# EAGLE design HVIBDC (EAGLE 9.5.1)
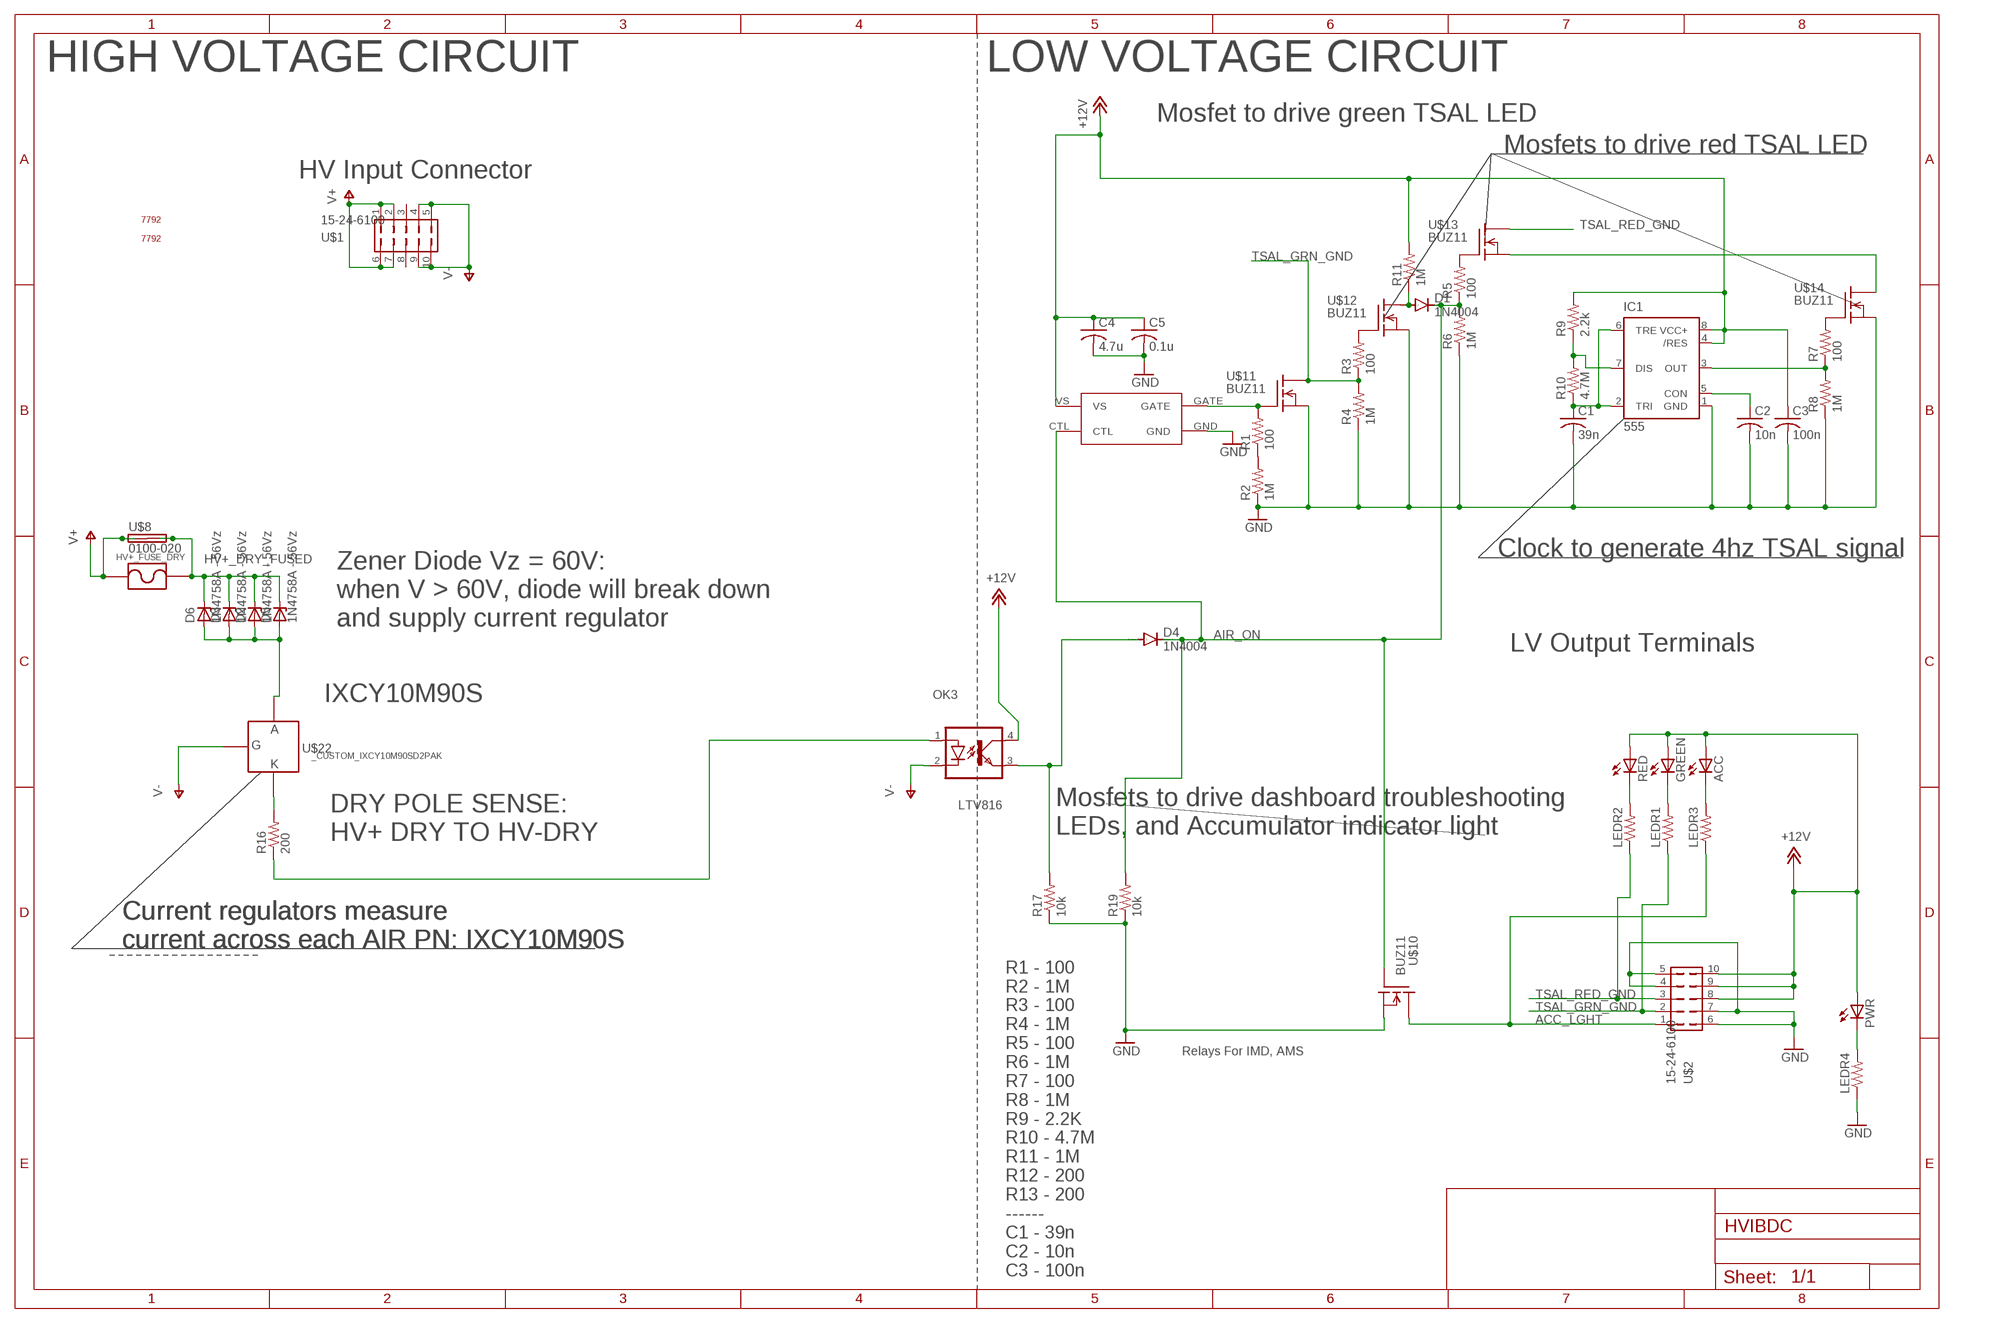
[diagram p0: schematic, sheet 1]

## Parts
ACC  LEDCHIPLED_0805  [CHIPLED_0805]
C1  39n  C-USC0805  [C0805]
C2  10n  C-USC0805  [C0805]
C3  100n  C-USC0805  [C0805]
C4  4.7u  C-USC0805  [C0805]
C5  0.1u  C-USC0805  [C0805]
D1  1N4004  [DO41-10]
D2  1N4758A - 56Vz  ZENER-DIODEZD-12.5  [ZDIO12.5]
D3  1N4758A - 56Vz  ZENER-DIODEZD-12.5  [ZDIO12.5]
D4  1N4004  [DO41-10]
D5  1N4758A - 56Vz  ZENER-DIODEZD-12.5  [ZDIO12.5]
D6  1N4758A - 56Vz  ZENER-DIODEZD-12.5  [ZDIO12.5]
GREEN  LEDCHIPLED_0805  [CHIPLED_0805]
HV+_FUSE_DRY  _CUSTOM_PARTS_LF_885  [_CUSTOM_PARTS_LF_885]
IC1  555  555P  [DIP08]
LEDR1  R-US_R0805  [R0805]
LEDR2  R-US_R0805  [R0805]
LEDR3  R-US_R0805  [R0805]
LEDR4  R-US_R0805  [R0805]
OK3  LTV816  [DIL04]
PWR  LEDCHIPLED_0805  [CHIPLED_0805]
R1  100  R-US_R0805  [R0805]
R2  1M  R-US_R0805  [R0805]
R3  100  R-US_R0805  [R0805]
R4  1M  R-US_R0805  [R0805]
R5  100  R-US_R0805  [R0805]
R6  1M  R-US_R0805  [R0805]
R7  100  R-US_R0805  [R0805]
R8  1M  R-US_R0805  [R0805]
R9  2.2k  R-US_R0805  [R0805]
R10  4.7M  R-US_R0805  [R0805]
R11  1M  R-US_R0805  [R0805]
R16  200  R-US_R2010  [R2010]
R17  10k  R-US_R0805  [R0805]
R19  10k  R-US_R0805  [R0805]
RED  LEDCHIPLED_0805  [CHIPLED_0805]
U$1  15-24-6100  [15-24-6100]
U$2  15-24-6100  [15-24-6100]
U$3  7792  [7792]
U$4  7792  [7792]
U$8  0100-020  [0100-020]
U$10  BUZ11  [TO220]
U$11  BUZ11  [TO220]
U$12  BUZ11  [TO220]
U$13  BUZ11  [TO220]
U$14  BUZ11  [TO220]
U$15  MIC4417  [PDM_2019_REVB_MIC4416YM4-TR]
U$22  _CUSTOM_IXCY10M90SD2PAK  [TO228P991X238-3]

## Nets
+12V: ACC.A C3.1 C4.1 C5.1 GREEN.A IC1.4(/RES) IC1.8(VCC+) OK3.4(COL) PWR.A R9.2 R11.2 RED.A U$2.8 U$2.9 U$2.10 U$15.VS
ACC_LGHT: LEDR3.1 U$2.1 U$10.2(D)
AIR_ON: D1.C D4.C R5.1 R6.2 R19.2 U$10.1(G) U$15.CTL
GND: C1.2 C2.2 C3.2 C4.2 C5.2 IC1.1(GND) LEDR4.1 R2.1 R4.1 R6.1 R8.1 R17.1 R19.1 U$2.4 U$2.5 U$2.6 U$2.7 U$10.3(S) U$11.3(S) U$12.3(S) U$14.3(S) U$15.GND
HV+_DRY_FUSED [HV]: D2.C D3.C D5.C D6.C HV+_FUSE_DRY.P$1 U$8.P$2(2A) U$8.P$4(2B)
N$1: R1.1 R2.2
N$2: R1.2 U$11.1(G) U$15.GATE
N$3: R3.2 U$12.1(G)
N$4: C2.1 IC1.5(CON)
N$5: IC1.7(DIS) R9.1 R10.2
N$6: R5.2 U$13.1(G)
N$7: R7.2 U$14.1(G)
N$8: IC1.3(OUT) R7.1 R8.2
N$9: C1.1 IC1.2(TRI) IC1.6(TRE) R10.1
N$10: ACC.C LEDR3.2
N$12: GREEN.C LEDR1.2
N$13: U$13.3(S) U$14.2(D)
N$14: D4.A OK3.3(EMIT) R17.2
N$15: D1.A R11.1 U$12.2(D)
N$16: LEDR2.2 RED.C
N$17: LEDR4.2 PWR.C
N$20 [HV]: R16.2 U$22.2(K)
N$21 [HV]: D2.A D3.A D5.A D6.A U$22.3(A)
N$22 [HV]: OK3.1(A) R16.1
TSAL_GRN_GND: LEDR1.1 R3.1 R4.2 U$2.2 U$11.2(D)
TSAL_RED_GND: LEDR2.1 U$2.3 U$13.2(D)
V+ [HV]: HV+_FUSE_DRY.P$2 U$1.1 U$1.2 U$1.6 U$1.7 U$8.P$1(1A) U$8.P$3(1B)
V- [HV]: OK3.2(C) U$1.4 U$1.5 U$1.9 U$1.10 U$22.1(G)
Unconnected: U$1.3 U$1.8

## Notes on the sheet
- HIGH VOLTAGE CIRCUIT | LOW VOLTAGE CIRCUIT
- Mosfet to drive green TSAL LED
- Mosfets to drive red TSAL LED
- HV Input Connector
- Clock to generate 4hz TSAL signal
- Zener Diode Vz = 60V: 
  when V > 60V, diode will break down 
  and supply current regulator
- LV Output Terminals
- IXCY10M90S
- Mosfets to drive dashboard troubleshooting
  LEDs, and Accumulator indicator light
- DRY POLE SENSE:
  HV+ DRY TO HV-DRY
- Current regulators measure 
  current across each AIR PN: IXCY10M90S
- Current regulators measure 
  current across each AIR PN: IXCY10M90S
- Current regulators measure 
  current across each AIR PN: IXCY10M90S
- Relays For IMD, AMS
- R1 - 100
  R2 - 1M
  R3 - 100
  R4 - 1M
  R5 - 100
  R6 - 1M
  R7 - 100
  R8 - 1M
  R9 - 2.2K
  R10 - 4.7M
  R11 - 1M
  R12 - 200
  R13 - 200
  ------
  C1 - 39n
  C2 - 10n
  C3 - 100n

## Library data of the parts
ACC GREEN PWR RED = ACC-MB-R0:LED: LED OSRAM: - CHIPLED LG R971, LG N971, LY N971, LG Q971, LY Q971, LO R971, LY R971 LH N974, LH R974 LS Q976, LO Q976, LY Q976 LO Q996 - Hyper CHIPLED LW Q18S LB Q993, LB Q99A, LB R99A - SideLED LS A670, LO A670, LY A670, LG A670, LP A670 LB A673, LV A673, LT A673, LW A673 LH A674 LY A675 LS A676, LA A676, LO A676, LY A676, LW A676 LS A679, LY A679, LG A679 - Hyper Micro SIDELED® LS Y876, LA Y876, LO Y876, LY Y876 LT Y87S - SmartLED LW L88C, LW L88S LB L89C, LB L89S, LG L890 LS L89K, LO L89K, LY L89K LS L896, LA L896, LO L896, LY L896 - TOPLED LS T670, LO T670, LY T670, LG T670, LP T670 LSG T670, LSP T670, LSY T670, LOP T670, LYG T670 LG T671, LOG T671, LSG T671 LB T673, LV T673, LT T673, LW T673 LH T674 LS T676, LA T676, LO T676, LY T676, LB T676, LH T676, LSB T676, LW T676 LB T67C, LV T67C, LT T67C, LS T67K, LO T67K, LY T67K, LW E67C LS E67B, LA E67B, LO E67B, LY E67B, LB E67C, LV E67C, LT E67C LW T67C LS T679, LY T679, LG T679 LS T770, LO T770, LY T770, LG T770, LP T770 LB T773, LV T773, LT T773, LW T773 LH T774 LS E675, LA E675, LY E675, LS T675 LS T776, LA T776, LO T776, LY T776, LB T776 LHGB T686 LT T68C, LB T68C - Hyper Mini TOPLED® LB M676 - Mini TOPLED Santana® LG M470 LS M47K, LO M47K, LY M47K Source: http://www.osram.convergy.de LUXEON: - LUMILED® LXK2-PW12-R00, LXK2-PW12-S00, LXK2-PW14-U00, LXK2-PW14-V00 LXK2-PM12-R00, LXK2-PM12-S00, LXK2-PM14-U00 LXK2-PE12-Q00, LXK2-PE12-R00, LXK2-PE12-S00, LXK2-PE14-T00, LXK2-PE14-U00 LXK2-PB12-K00, LXK2-PB12-L00, LXK2-PB12-M00, LXK2-PB14-N00, LXK2-PB14-P00, LXK2-PB14-Q00 LXK2-PR12-L00, LXK2-PR12-M00, LXK2-PR14-Q00, LXK2-PR14-R00 LXK2-PD12-Q00, LXK2-PD12-R00, LXK2-PD12-S00 LXK2-PH12-R00, LXK2-PH12-S00 LXK2-PL12-P00, LXK2-PL12-Q00, LXK2-PL12-R00 Source: www.luxeon.com KINGBRIGHT: KA-3528ASYC Source: www.kingbright.com
C1-C5 = resistor:C-US: CAPACITOR, American symbol
D1 D4 = diode:1N4004: DIODE general purpose rectifier, 1 A
D2 D3 D5 D6 = Main:ZENER-DIODE: Z-Diode
HV+_FUSE_DRY = Main:_CUSTOM_PARTS_LF_885
IC1 = SparkFun-IC-Special-Function:555: General purpose bipolar Timer Datasheet <http://www.sparkfun.com/datasheets/Components/General/ne555.pdf> SparkFun Products SparkFun SparkPunk Sequencer Kit <https://www.sparkfun.com/products/12707> (KIT-12707) Storefront Component: 555 Timer <https://www.sparkfun.com/products/9273> (COM-09273) Two parts valid for production: VFP: IC-11930 (M7555 PTH) VFP: IC-09173 (555 PTH) - Preferred; PROD_ID: IC-09173; PROD_ID_ALT: IC-09173
LEDR1-LEDR4 = ACC-MB-R0:R-US_: RESISTOR, American symbol; SPICEPREFIX: R
OK3 = optocoupler:LTV816: OPTO COUPLER Source: LITEON, LTV816.pdf; OC_FARNELL: unknown; OC_NEWARK: unknown
R1-R11 R17 R19 = resistor:R-US_: RESISTOR, American symbol
R16 = Main:R-US_: RESISTOR, American symbol; SPICEPREFIX: R
U$1 U$2 = ACC-MB-R0:15-24-6100
U$3 U$4 = ACC-MB-R0:7792
U$8 = ACC-MB-R0:0100-020
U$10-U$14 = transistor-fet:BUZ11: N-Channel Enhancement MOSFET 50V; 30A; 0,040Ohm
U$15 = HVIB_v2:MIC4417; MPN: MIC4417
U$22 = Main:_CUSTOM_IXCY10M90S

## Net classes
0 default: width 0.2 mm, clearance 0.2 mm
2 HV: width 1.27 mm, clearance 1.5 mm to class 0, clearance 1.5 mm to class 1, clearance 1.5 mm

## Board
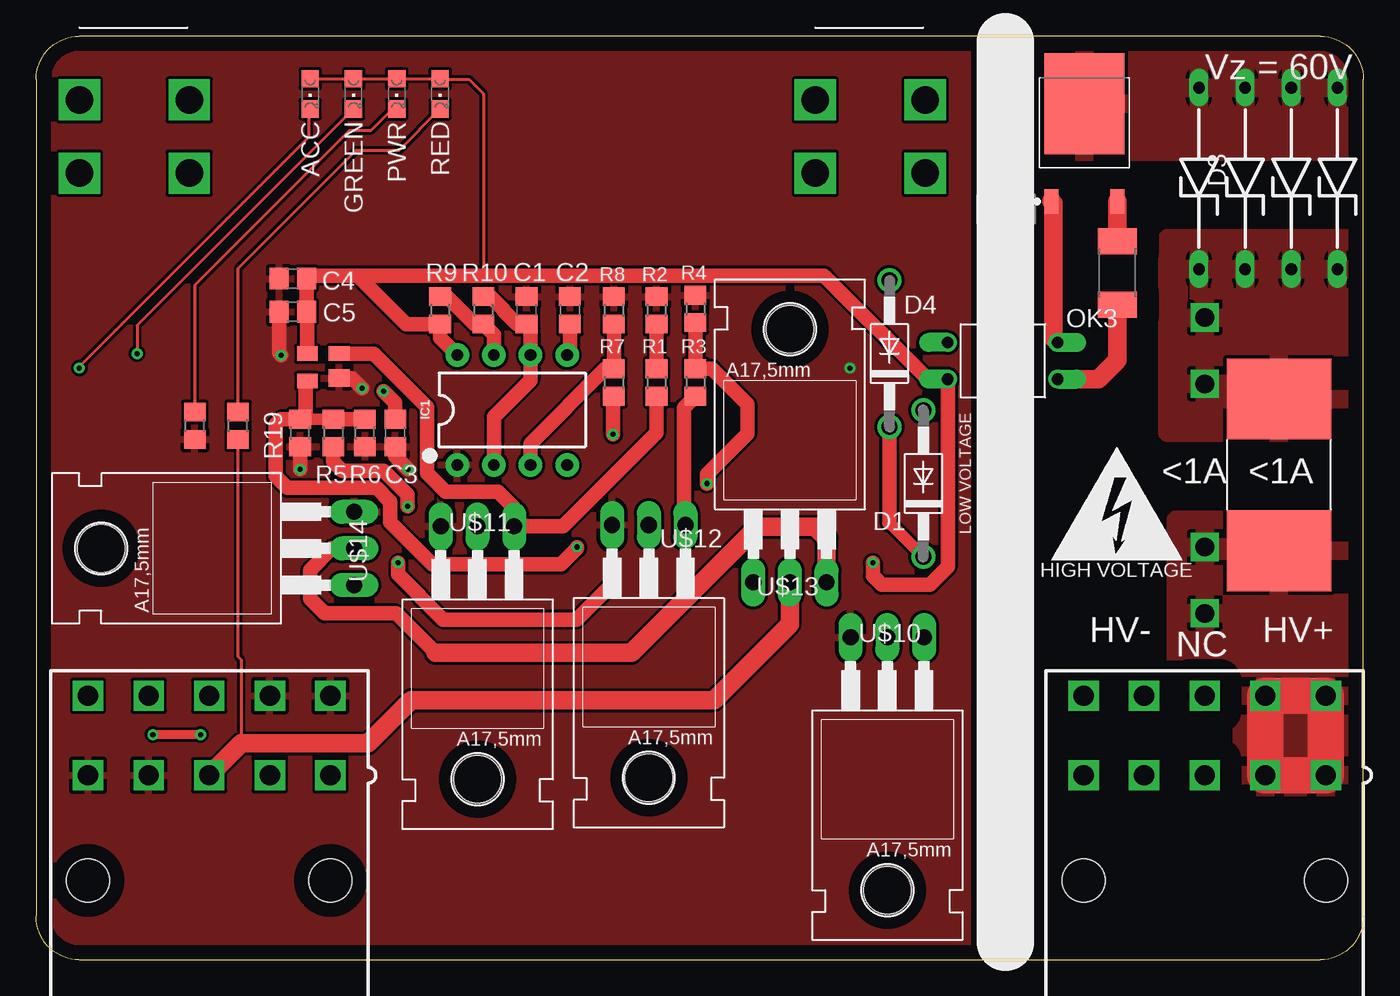
[diagram p1: board, top side]
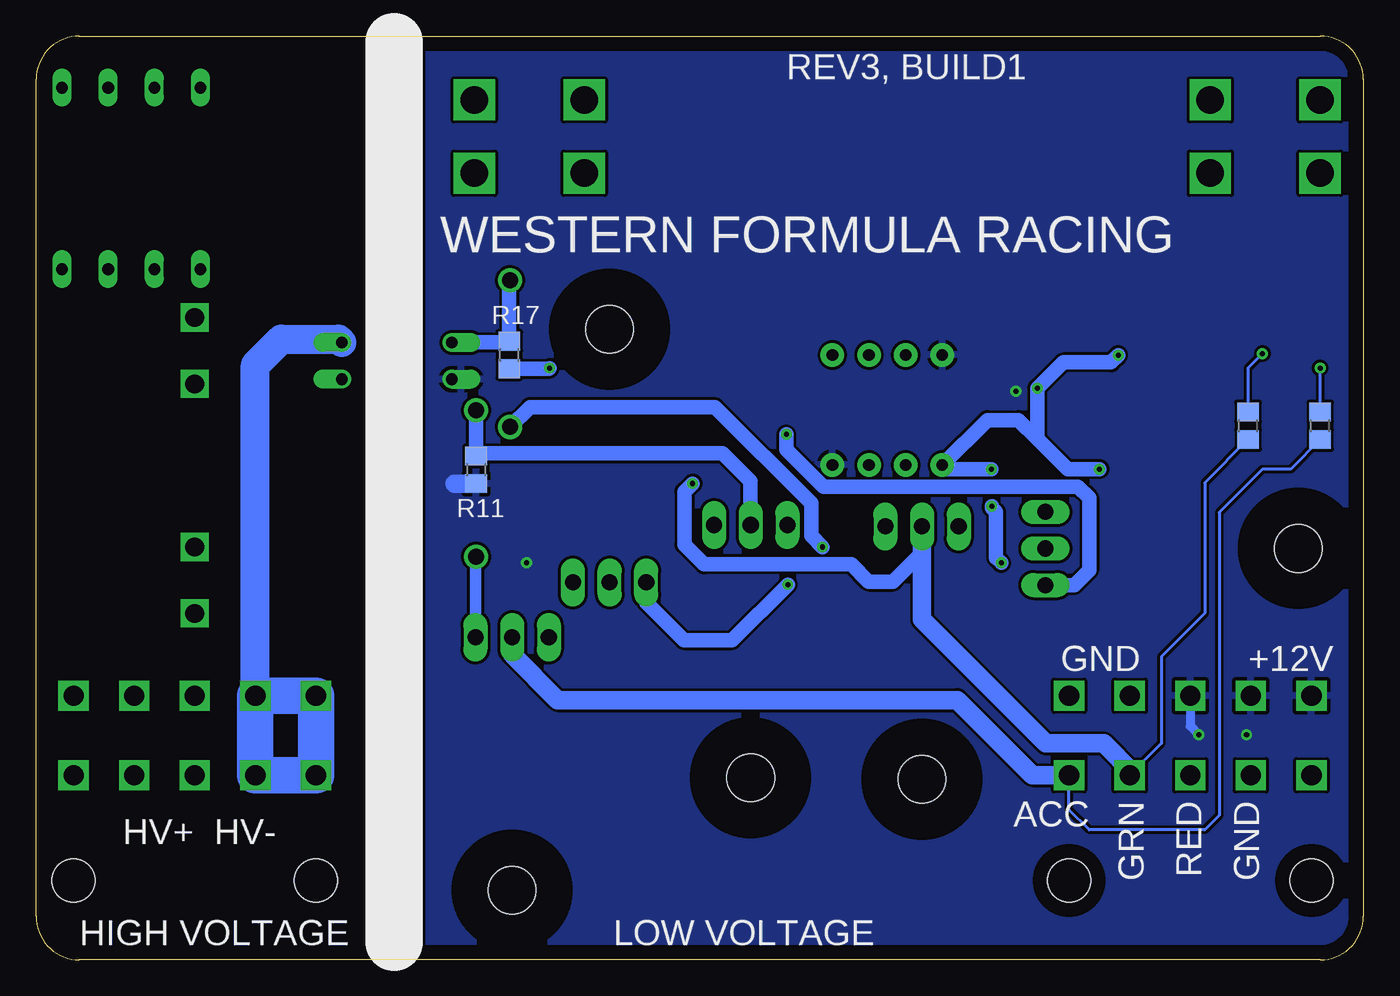
[diagram p2: board, bottom side, seen from below]

Size 92 x 64 mm. Coordinates in mm from the lower left corner, seen from the top.
Outline: 3,0 89,0 arc90 92,3 92,61 arc90 89,64 3,64 arc90 0,61 0,3 arc90 3,0
Copper layers (1*16): Top 0.035mm / dielectric 1.5mm / Bottom 0.035mm
Design rules "default": minimum track width 6mil, minimum drill 0.35mm, track to track 6mil, track to pad 6mil, pad to pad 6mil, via to via 6mil, smd to smd 6mil, copper to edge 40mil, drill to drill 6mil, minimum pad ring 10mil, minimum via ring 8mil, stop-mask expansion 4mil, vias tented up to drill 0mil, thermal gap 10mil

### Footprints (pad centres in the part's own frame; a part is rotated, then mirrored left to right if it is on the bottom)
CHIPLED_0805 = smd 1.2 x 1.2: A 0,-1.05; C 0,1.05
C0805 = smd 1.3 x 1.5: 1 -0.95,0; 2 0.95,0
DO41-10 = drill 1.118: A 5.08,0; C -5.08,0
ZDIO12.5 = drill 0.813 long: A 6.223,0; C -6.35,0
_CUSTOM_PARTS_LF_885 = smd 5.6 x 7.23: P$1 5.25,0; P$2 -5.25,0
DIP08 = drill 0.813 pad 1.626: 1 -3.81,-3.81; 2 -1.27,-3.81; 3 1.27,-3.81; 4 3.81,-3.81; 5 3.81,3.81; 6 1.27,3.81; 7 -1.27,3.81; 8 -3.81,3.81
R0805 = smd 1.3 x 1.5: 1 -0.95,0; 2 0.95,0
DIL04 = drill 0.813 offset: 1 -1.27,-3.81; 2 1.27,-3.81; 3 1.27,3.81; 4 -1.27,3.81
R2010 = smd 1.8 x 2.7: 1 -2.2,0; 2 2.2,0
15-24-6100 = drill 1.4 square: 1 8.4,-2.75; 2 4.2,-2.75; 3 0,-2.75; 4 -4.2,-2.75; 5 -8.4,-2.75; 6 8.4,2.75; 7 4.2,2.75; 8 0,2.75; 9 -4.2,2.75; 10 -8.4,2.75 | hole 3: 8.4,-10.05; -8.4,-10.05
7792 = drill 1.905 square: P$1 0,5.08; P$2 7.62,5.08; P$3 7.62,0; P$4 0,0
0100-020 = drill 1.3 square: P$1 0,0; P$2 15.9,0; P$3 4.6,0; P$4 20.5,0
TO220 = drill 1.118 long: 1 -2.54,-6.35; 2 0,-6.35; 3 2.54,-6.35 | hole 3.302: 0,11.176
PDM_2019_REVB_MIC4416YM4-TR = smd 1 x 1.44: CTL 0,0; GATE 1.9,-2.2; VS 1.9,0 | smd 1.2 x 1.44: GND 0.2,-2.2
TO228P991X238-3 = smd 1.718 x 0.974: 1 -4.704,2.28; 2 -4.704,-2.28 | smd 7.001 x 5.544: 3 2.063,0

### Placement (x,y rotation side)
ACC  19,60 180 top
C1  34,45 90 top
C2  37,45 90 top
C3  24.9,36.5 270 top
C4  17.8,47.2 180 top
C5  17.8,44.9 180 top
D1  61.5,33 90 top
D2  87,54.2 90 top
D3  90.2,54.2 90 top
D4  59.15,42 90 top
D5  80.6,54.2 90 top
D6  83.8,54.2 90 top
GREEN  22,60 180 top
HV+_FUSE_DRY  86.15,33.6 90 top
IC1  33,38.1 0 top
LEDR1  8,37 90 bottom
LEDR2  14,37 90 top
LEDR3  3,37 90 bottom
LEDR4  11,37 90 top
OK3  67,41.5 90 top
PWR  25,60 180 top
R1  43,40 270 top
R2  43,45 270 top
R3  45.7,40 270 top
R4  45.7,45.1 270 top
R5  20.6,36.5 270 top
R6  22.8,36.5 90 top
R7  40.05,40 270 top
R8  40.05,45 270 top
R9  28,45 270 top
R10  31,45 270 top
R11  61.5,33.95 270 bottom
R16  74.95,47.6 90 top
R17  59.2,41.9 90 bottom
R19  18.3,36.5 90 top
RED  28,60 180 top
U$1  81,15.54 0 top
U$2  12,15.54 0 top
U$3  54,54.5 0 top
U$4  3,54.5 0 top
U$8  81,24 90 top
U$10  59,16 180 top
U$11  30.59,23.68 180 top
U$12  42.47,23.78 180 top
U$13  52.25,32.5 0 top
U$14  15.7,28.5 90 top
U$15  18.8,40.1 90 top
U$22  72.65,57.25 90 top

### Tracks (layer width: path | path; a pad name or v marks a point on that pad's centre or on a via)
+12V  (via drill 0.35)
  Top 0.2: RED.A 28.05,61.05 | ACC.A GREEN.A PWR.A RED.A | RED.A 28.05,61 30,61 31,60 31,47.4
  Top 0.61: v11.4,15.6 v8.1,15.6
  Top 1: IC1.8 28,43.1 R9.2 25.65,44.05 22.3,47.4 | U$15.VS 18.8,44.85 C5.1 C4.1 18.95,47.4 22.3,47.4 | C3.1 24.9,38.6 v24.1,39.4 | 22.3,47.4 31,47.4 54.62,47.4 61.81,40.21 63.17,40.21 OK3.4 63.19,27.23 61.94,25.98 58.61,25.98 58,26.59 v58,27.5
  Bottom 0.61: U$2.8 12,16.2 v11.4,15.6
  Bottom 1.27: R11.2 63,33
  pour Bottom: -0.9,66.1 64.8,66.1 64.8,-1 -0.9,-1
ACC_LGHT
  Bottom 0.2: LEDR3.1 5.05,34 7,34 10,31 10,10 11,9 19,9 20.4,10.4 U$2.1
  Bottom 1.27: U$10.2 58.99,22.34 58.99,21.14 55.85,18 28.15,18 22.94,12.79 U$2.1
AIR_ON  (via drill 0.35)
  Top 0.813: D1.C 59.15,30.27 | R5.1 R19.2
  Top 1: U$15.CTL 18.7,40.1 18.7,37.85 R19.2 16.97,37.45 16.62,37.1 16.62,33.5 17.42,32.7 23.6,32.7 24.55,31.75 24.55,30.31 27.46,27.4 36.4,27.4 37.5,28.5 v37.5,28.6 | 59.15,30.27 D4.C | R5.1 R6.2
  Bottom 0.813: U$10.1 61.54,27.88 D1.C
  Bottom 1: v37.5,28.6 38.27,29.37 38.27,31.62 44.95,38.3 57.77,38.3 D4.C
  Bottom 1.27: 61.5,22.39 U$10.1
GND  (via drill 0.35)
  Top 1: U$15.GND 21.9,40.3 v22.6,39.6 | C5.2 16.85,42.05 v17,41.9 | R19.1 v18.3,34 | C3.2 24.9,34.9 v25.8,34
  Bottom 1: 22.6,36.1 v22.6,39.6 20.8,41.4 17.5,41.4 v17,41.9 | R17.1 56.45,40.95 v56.4,41 | v18.3,34 20.5,34 22.6,36.1 | 22.6,36.1 23.9,37.4 26.08,37.4 IC1.1 28.9,34 v25.8,34
  pour Top: -1,65.9 64.55,65.9 64.55,-1 -1,-1
HV+_DRY_FUSED
  pour Top: 78.4,36.5 96,36.5 96,50 78.4,50
N$1
  Top 1: R2.2 R1.1
N$2
  Top 1: R1.2 43,36.5 36.53,30.03 U$11.1 33.13,31.33 32.04,32.43 28.37,32.43 27.1,33.7 27.1,38.3 23.4,42 U$15.GATE
N$3
  Top 1: R3.2 44.9,38.25 44.9,30.23 U$12.1
N$4
  Top 1: C2.1 37,42.1 IC1.5
N$5
  Top 1: R9.1 28.49,45.95 30.39,44.05 R10.2 31.73,43.32 IC1.7
N$6  (via drill 0.35)
  Top 1: v39.9,26 37.47,23.57 28.23,23.57 25.1,26.7 v25.1,27.5 | v25.77,31.43 25.77,32.23 24.1,33.9 21.2,33.9 20.6,34.5 R5.2
  Bottom 1: U$13.1 49.71,24.76 47.1,22.15 43.75,22.15 v39.9,26 | v25.1,27.5 25.47,27.87 25.47,31.04 25.77,31.34 v25.77,31.43
N$7  (via drill 0.35)
  Top 1: v40,36.4 40,39 R7.2
  Bottom 1: v40,36.4 40,35.34 37.44,32.78 19.78,32.78 19,32 19,27 20.04,25.96 U$14.1
N$8
  Top 1: R8.2 R7.1 39.45,40.95 34.27,35.77 IC1.3
N$9
  Top 1: R10.1 31.49,45.95 32.45,44.99 32.45,44.95 33.35,44.05 C1.1 34.27,43.78 IC1.6 34.27,40.17 31.73,37.63 IC1.2
N$10  (via drill 0.35)
  Top 0.2: ACC.C 18.9,58.85 18.9,57 3,41.1 v3,41
  Bottom 0.2: LEDR3.2 v3,41
N$12  (via drill 0.35)
  Top 0.2: GREEN.C 7,43.95 v7,42
  Bottom 0.2: v7,42 8,41 LEDR1.2
N$13
  Top 1: 27.69,21.26 24.95,24 20,24 19,25 19,27 20.5,28.5 U$14.2
  Top 1.27: U$13.3 54.79,29.21 54,30 50,30 41.26,21.26 27.69,21.26
N$14
  Bottom 1: D4.A 59.2,47.03 R17.2 59.28,42.77 OK3.3
N$15
  Bottom 1: D1.A R11.1 61.3,35.1 44.43,35.1 42.47,33.14 U$12.2
N$16
  Top 0.2: LEDR2.2 14,47.9 22.2,56.1 25.15,56.1 RED.C
N$17
  Top 0.2: PWR.C 24.7,58.95 23.2,57.45 21.7,57.45 11,46.75 LEDR4.2
N$20
  Top 1.27: R16.2 74.95,52.53 U$22.2
N$21
  pour Top: 71,66 71,56 95,56 95,66
N$22
  Top 1.27: OK3.1 73.63,40.23 74.95,41.55 R16.1
TSAL_GRN_GND  (via drill 0.35)
  Top 0.2: 46.15,44.15 R4.2
  Top 1: R4.2 R3.1 46.85,40.95 49.3,38.5 49.3,36.44 46.5,33.64 v46.5,33
  Bottom 0.2: LEDR1.1 11,33.05 11,24 14,21 14,14.99 16,12.99
  Bottom 1: U$11.2 30.59,28.21 32.6,26.2 34.3,26.2 35.5,27.4 45.7,27.4 47.07,28.77 47.07,32.43 v46.5,33
  Bottom 1.27: U$11.2 30.59,23.59 22,15 18,15 16,13 16,12.99 U$2.2
TSAL_RED_GND
  Top 0.2: 14,36 LEDR2.1 14,21 14.21,20.79 14.21,15
  Top 1.27: U$13.2 52.25,23.25 47,18 26,18 23,15 14.21,15 U$2.3
V+
  Top 2.54: U$1.7 U$1.6 U$1.1 U$1.2 U$1.7
  pour Top: 79,11.95 96,11.95 96,30.5 79,30.5
V-
  Top 1.27: U$22.1 70.51,52.41 70.51,43.07 OK3.2
  Bottom 2: U$1.9 76.8,41.2 75,43 71.04,43 OK3.2
  Bottom 2.54: U$1.9 U$1.10 U$1.5 U$1.4 U$1.9

### Text on the board
tPlace: LOW VOLTAGE | HIGH VOLTAGE
tNames: Vz = 60V | <1A | <1A | HV- | HV+ | NC
bNames: REV3, BUILD1 | WESTERN FORMULA RACING | +12V | GND | GND | RED | GRN | ACC | HV+ HV- | LOW VOLTAGE | HIGH VOLTAGE